# Altium schematic sheet 6.HDMI&AUD.SchDoc
size A4
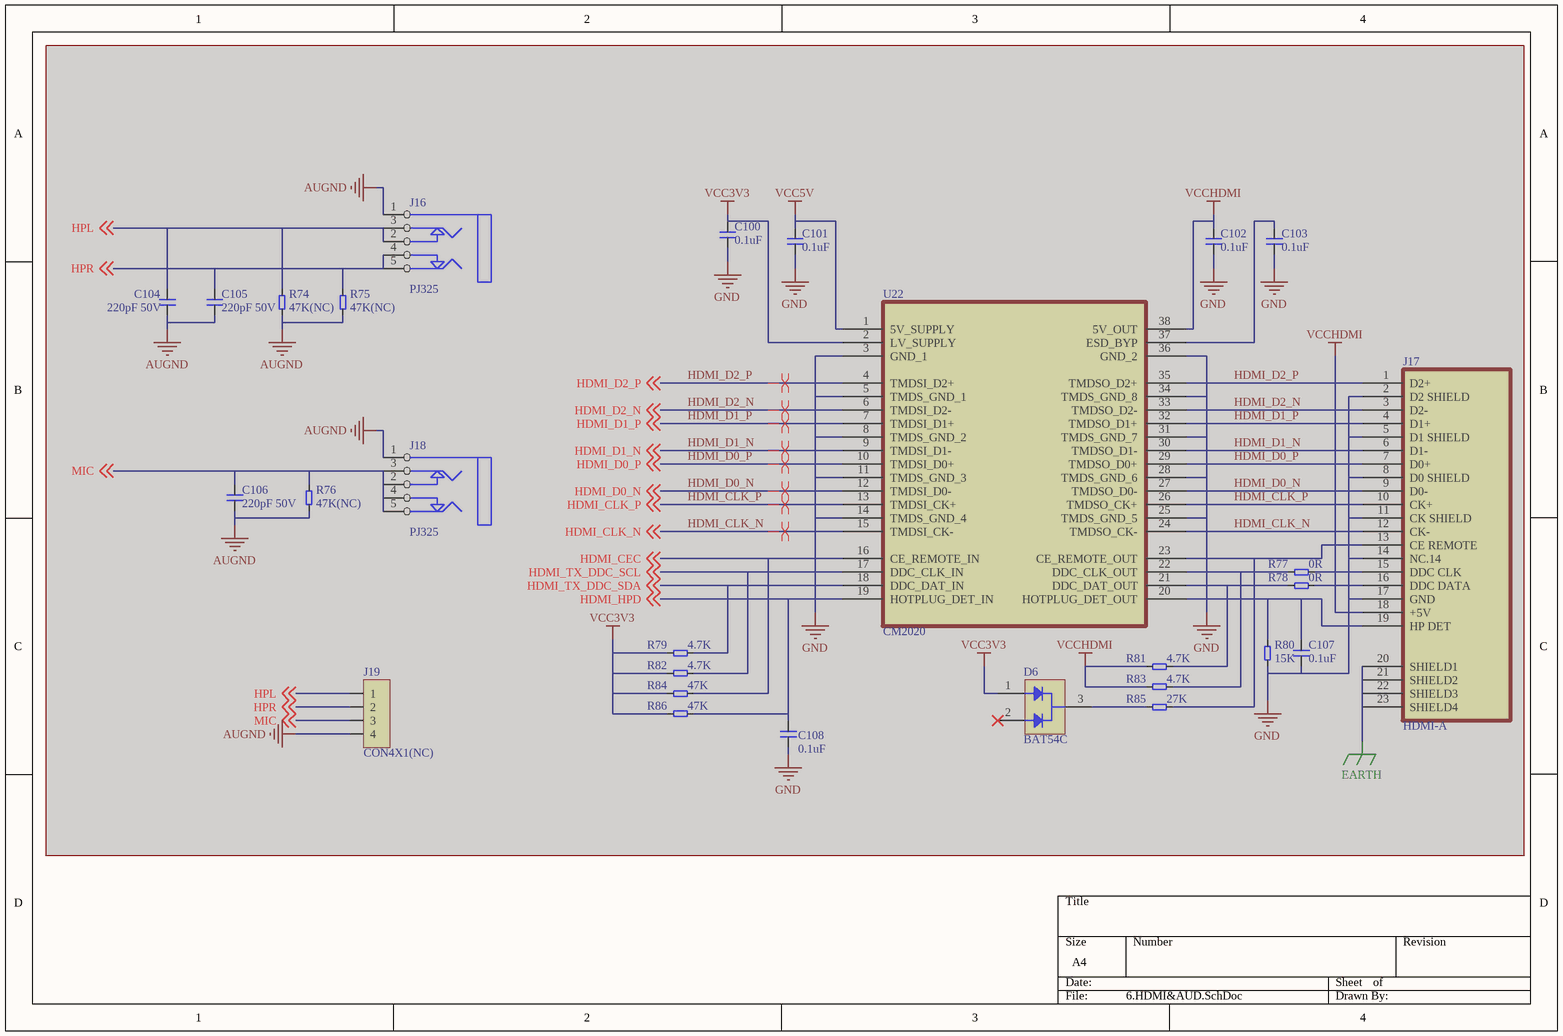
[diagram p0: 6.HDMI&AUD.SchDoc]

## Parts
C100  0.1uF  [0603C]  (masked out: inside a compile mask, not in the netlist)
C101  0.1uF  [0603C]  (masked out: inside a compile mask, not in the netlist)
C102  0.1uF  [0603C]  (masked out: inside a compile mask, not in the netlist)
C103  0.1uF  [0603C]  (masked out: inside a compile mask, not in the netlist)
C104  220pF 50V  [0603C]  (masked out: inside a compile mask, not in the netlist)
C105  220pF 50V  [0603C]  (masked out: inside a compile mask, not in the netlist)
C106  220pF 50V  [0603C]  (masked out: inside a compile mask, not in the netlist)
C107  0.1uF  [0603C]  (masked out: inside a compile mask, not in the netlist)
C108  0.1uF  [0603C]  (masked out: inside a compile mask, not in the netlist)
D6  BAT54C  [SOT-23]  (masked out: inside a compile mask, not in the netlist)
J16  PJ325  [PJ325]  (masked out: inside a compile mask, not in the netlist)
J17  HDMI-A  [HDMI-A]  (masked out: inside a compile mask, not in the netlist)
J18  PJ325  [PJ325]  (masked out: inside a compile mask, not in the netlist)
J19  CON4X1(NC)  [IDC4X1-2.54mm]  (masked out: inside a compile mask, not in the netlist)
R74  47K(NC)  [0603R]  (masked out: inside a compile mask, not in the netlist)
R75  47K(NC)  [0603R]  (masked out: inside a compile mask, not in the netlist)
R76  47K(NC)  [0603R]  (masked out: inside a compile mask, not in the netlist)
R77  0R  [0603R]  (masked out: inside a compile mask, not in the netlist)
R78  0R  [0603R]  (masked out: inside a compile mask, not in the netlist)
R79  4.7K  [0603R]  (masked out: inside a compile mask, not in the netlist)
R80  15K  [0603R]  (masked out: inside a compile mask, not in the netlist)
R81  4.7K  [0603R]  (masked out: inside a compile mask, not in the netlist)
R82  4.7K  [0603R]  (masked out: inside a compile mask, not in the netlist)
R83  4.7K  [0603R]  (masked out: inside a compile mask, not in the netlist)
R84  47K  [0603R]  (masked out: inside a compile mask, not in the netlist)
R85  27K  [0603R]  (masked out: inside a compile mask, not in the netlist)
R86  47K  [0603R]  (masked out: inside a compile mask, not in the netlist)
U22  CM2020  [TSSOP-38]  (masked out: inside a compile mask, not in the netlist)

## Layout directives
differential pair: (no net found under the mark)

## Library data of the parts
C100-C108 = 电容
D6 = BAT54C: SCHOTTKY DIODE
J19 = CON4X1
R74-R86 = 电阻